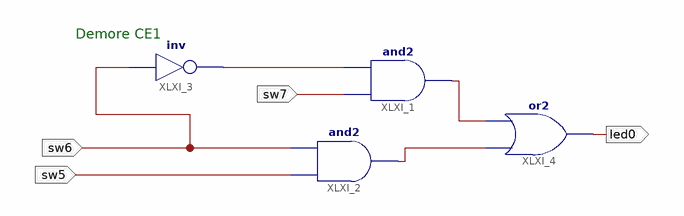
[diagram p0: schematic sheet 1]
// Xilinx ISE schematic Demore_CE1_top.sch (spartan3e) as structural Verilog: 4 symbols, 4 ports
module Demore_CE1_top (
  input  sw7,
  input  sw5,
  input  sw6,
  output led0
);

  wire XLXN_2, XLXN_3, XLXN_5;

  and XLXI_1 (XLXN_3, sw7, XLXN_2);
  and XLXI_2 (XLXN_5, sw5, sw6);
  not XLXI_3 (XLXN_2, sw6);
  or XLXI_4 (led0, XLXN_5, XLXN_3);

  // Notes on the sheet:
  //   Demore CE1
endmodule
